# Altium schematic sheet MainBoard_V100_DISP.SchDoc
size A4; SheetNumber: 21; SheetTotal: 22; Title_: Display
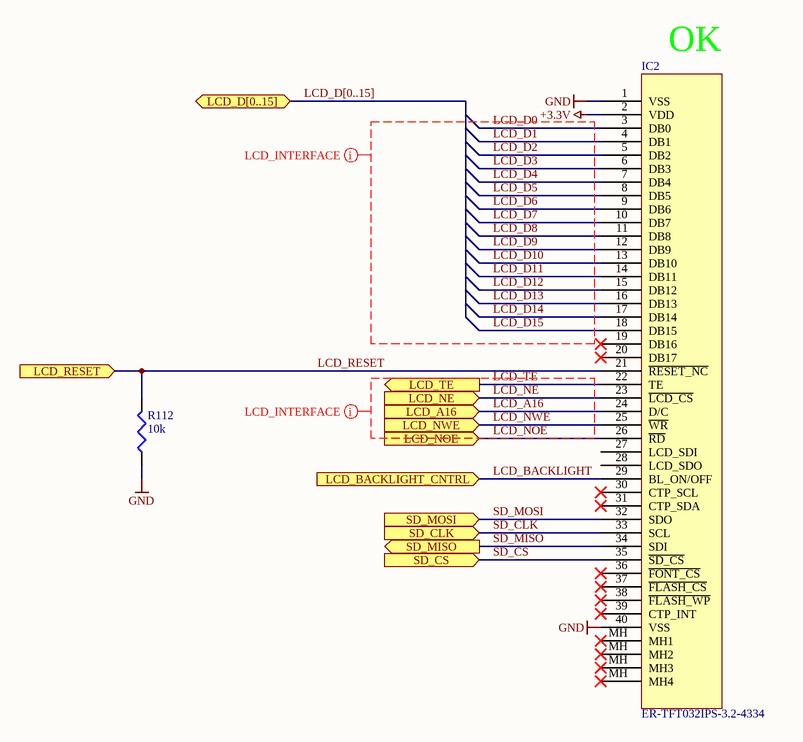
[diagram p0: MainBoard_V100_DISP.SchDoc]

## Parts
IC2  ER-TFT032IPS-3.2-4334  [ER-TFT032IPS-3.2]
R112  10k  [0805]

## Ports
LCD_A16 (in), LCD_BACKLIGHT_CNTRL (in), LCD_D[0..15] (bidir), LCD_NE (in), LCD_NOE (in), LCD_NWE (in), LCD_RESET (in), LCD_TE (out), SD_CLK (in), SD_CS (in), SD_MISO (out), SD_MOSI (in)

## Nets
+3.3V: IC2.2(VDD)
GND: IC2.1(VSS) IC2.40(VSS) R112.1
LCD_A16: IC2.24(D/C) ; port LCD_A16
LCD_BACKLIGHT: IC2.29(BL_ON/OFF) ; port LCD_BACKLIGHT_CNTRL
LCD_D0: IC2.3(DB0)
LCD_D1: IC2.4(DB1)
LCD_D2: IC2.5(DB2)
LCD_D3: IC2.6(DB3)
LCD_D4: IC2.7(DB4)
LCD_D5: IC2.8(DB5)
LCD_D6: IC2.9(DB6)
LCD_D7: IC2.10(DB7)
LCD_D8: IC2.11(DB8)
LCD_D9: IC2.12(DB9)
LCD_D10: IC2.13(DB10)
LCD_D11: IC2.14(DB11)
LCD_D12: IC2.15(DB12)
LCD_D13: IC2.16(DB13)
LCD_D14: IC2.17(DB14)
LCD_D15: IC2.18(DB15)
LCD_NE: IC2.23(~{LCD_CS}) ; port LCD_NE
LCD_NOE: IC2.26(~{RD}) ; port LCD_NOE
LCD_NWE: IC2.25(~{WR}) ; port LCD_NWE
LCD_RESET: IC2.21(~{RESET_NC}) R112.2 ; port LCD_RESET
LCD_TE: IC2.22(TE) ; port LCD_TE
SD_CLK: IC2.33(SCL) ; port SD_CLK
SD_CS: IC2.35(~{SD_CS}) ; port SD_CS
SD_MISO: IC2.34(SDI) ; port SD_MISO
SD_MOSI: IC2.32(SDO) ; port SD_MOSI

Not connected (* = marked no-connect by the designer): IC2 19(DB16)* 20(DB17)* 27(LCD_SDI) 28(LCD_SDO) 30(CTP_SCL)* 31(CTP_SDA)* 36(~{FONT_CS})* 37(~{FLASH_CS})* 38(~{FLASH_WP})* 39(CTP_INT)* MH(MH1)*

## Buses and harness runs
bus LCD_D[0..15] = port LCD_D[0..15]

## Layout directives
net class LCD_INTERFACE: LCD_A16, LCD_D0, LCD_D1, LCD_D2, LCD_D3, LCD_D4, LCD_D5, LCD_D6, LCD_D7, LCD_D8, LCD_D9, LCD_D10, LCD_D11, LCD_D12, LCD_D13, LCD_D14, LCD_D15, LCD_NE, LCD_NOE, LCD_NWE, LCD_TE

## Notes on the sheet
- (near IC2) OK
- Board:
- Author:
- Title:
- Project:
- SVN:
- Version:
- Sheet:
- of
- Contact:
- Modified:
- Size:
- A4

## Library data of the parts
IC2 = 392: 3.2 inch 240x320 IPS TFT LCD Module; Azonosító: 392; Part Number: ER-TFT032IPS-3.2-4334; Category: Optoelectronics; Subcategory: OPTO_Display; Supplier 1: buydisplay.com; Supplier 1 order number: ER-TFT032IPS-3.2-4334; Help URL: https://www.buydisplay.com/download/manual/ER-TFT032IPS-3.2-4334_Datasheet.pdf
R112 = 59: 10k 0805 0.125W 1%; Part Number: SMD0805-10k 1%; Azonosító: 59; Category: Passives; Subcategory: PASS_Resistor; Supplier 1: HESTORE; Supplier 1 order number: 100.403.38